# EAGLE schematic KMO_SRV_MV1 (EAGLE 9.1.3)

## Sheet 1 of 2
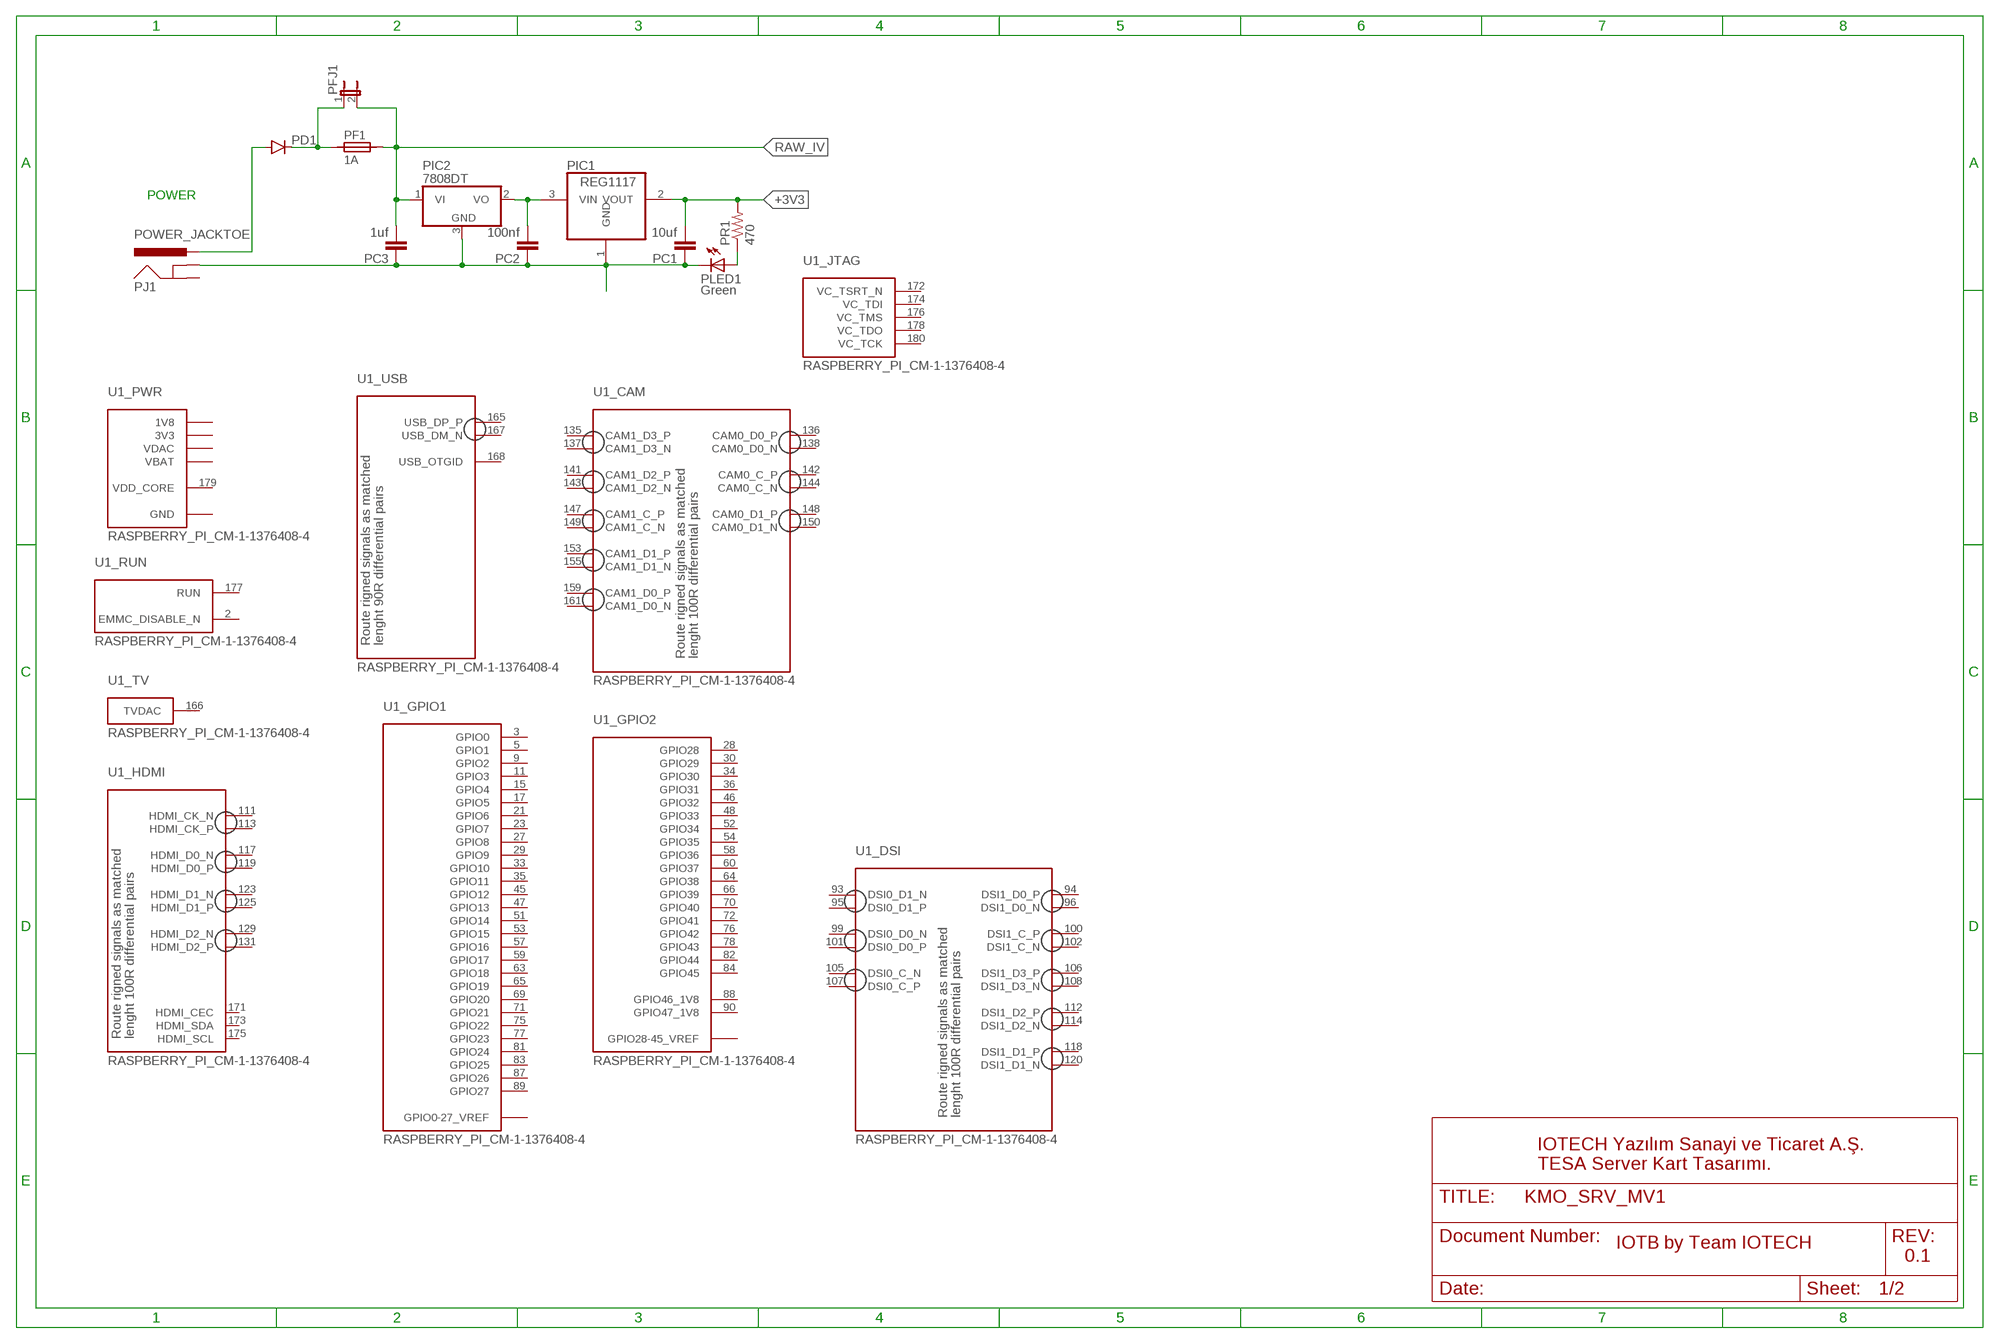
[diagram p0: schematic, sheet 1, part 1 of 2]
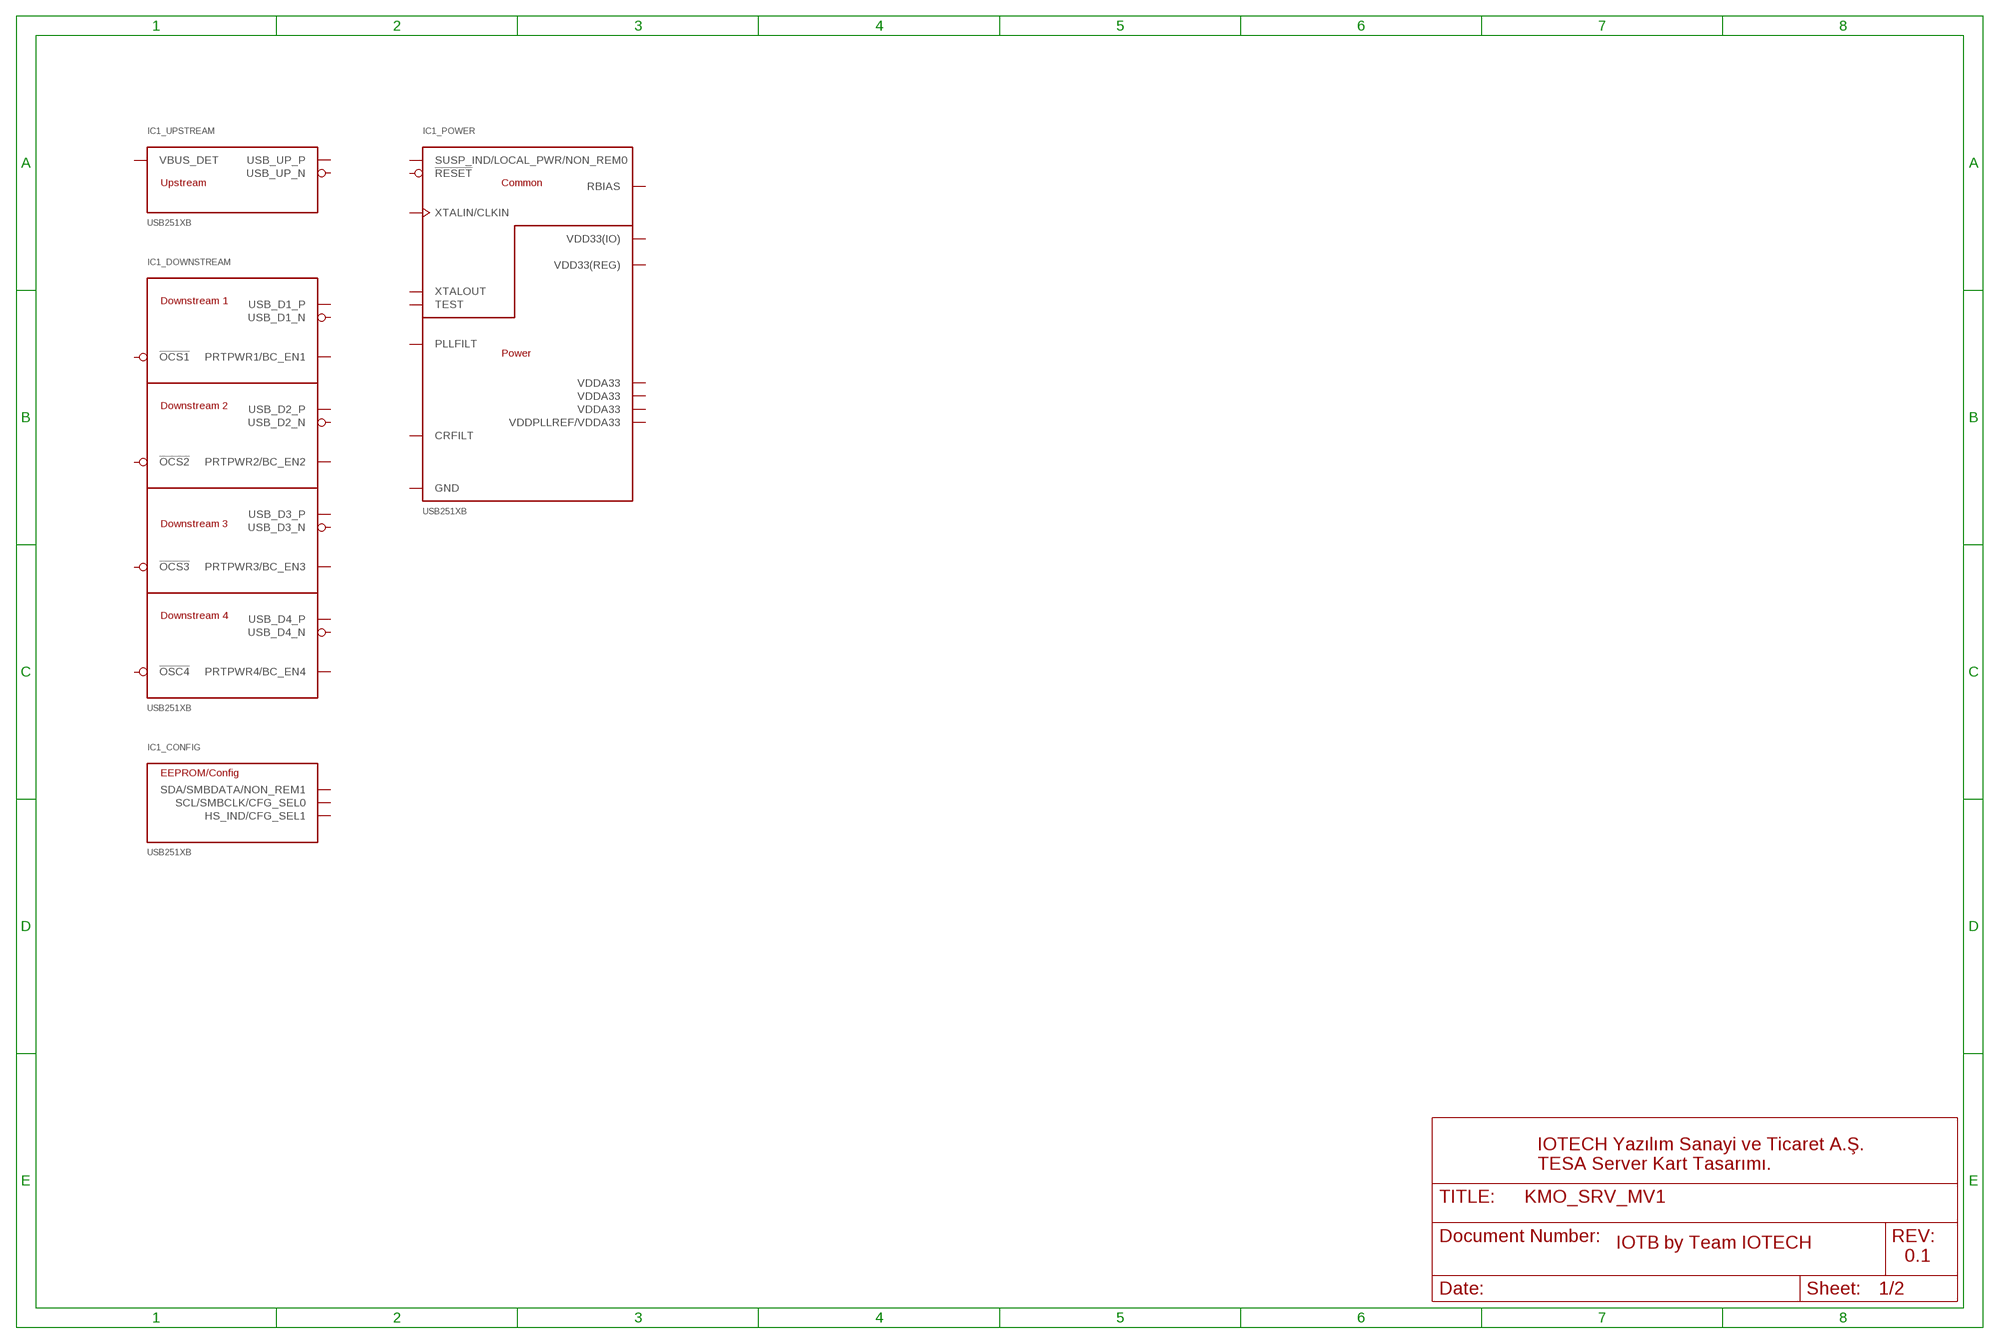
[diagram p1: schematic, sheet 1, part 2 of 2]

### Parts
IC1  USB251XB  [QFN36-CENTRE-MASK]
PC1  10uf  CAP0805  [0805]
PC2  100nf  CAP0805  [0805]
PC3  1uf  CAP0805  [0805]
PD1  DIODESMA  [SMA-DIODE]
PF1  1A  SIBA194600  [1820]
PFJ1  JP1E  [JP1]
PIC1  REG1117  [SOT223]
PIC2  7808DT  [TO252]
PJ1  POWER_JACKTOE  [POWER_JACK_SMD_OVERPASTE_TOE]
PLED1  Green  LEDCHIP-LED0805  [CHIP-LED0805]
PR1  470  RESISTOR0805-RES  [0805]
U1  RASPBERRY_PI_CM-1-1376408-4  [1-1376408-4]

### Nets
+3V3: PC1.2 PIC1.2(VOUT) PR1.2
N$2: PD1.C PF1.1 PFJ1.1
N$5: PC1.1 PC2.1 PC3.1 PIC1.1(GND) PIC2.3(GND) PJ1.GND(GNDBREAK) PLED1.C
N$7: PD1.A PJ1.VIN0(PWR)
N$11: PLED1.A PR1.1
N$12: PC2.2 PIC1.3(VIN) PIC2.2(VO)
RAW_IV [vcc]: PC3.2 PF1.2 PFJ1.2 PIC2.1(VI)
Unconnected: IC1.1(_DOWNSTREAM:USB_D1_N) IC1.2(_DOWNSTREAM:USB_D1_P) IC1.3(_DOWNSTREAM:USB_D2_N) IC1.4(_DOWNSTREAM:USB_D2_P) IC1.6(_DOWNSTREAM:USB_D3_N) IC1.7(_DOWNSTREAM:USB_D3_P) IC1.8(_DOWNSTREAM:USB_D4_N) IC1.9(_DOWNSTREAM:USB_D4_P) IC1.11(_POWER:TEST) IC1.12(_DOWNSTREAM:PRTPWR1/BC_EN1) IC1.13(_DOWNSTREAM:!OCS1) IC1.14(_POWER:CRFILT) IC1.16(_DOWNSTREAM:PRTPWR2/BC_EN2) IC1.17(_DOWNSTREAM:!OCS2) IC1.18(_DOWNSTREAM:PRTPWR3/BC_EN3) IC1.19(_DOWNSTREAM:!OCS3) IC1.20(_DOWNSTREAM:PRTPWR4/BC_EN4) IC1.21(_DOWNSTREAM:!OSC4) IC1.22(_CONFIG:SDA/SMBDATA/NON_REM1) IC1.24(_CONFIG:SCL/SMBCLK/CFG_SEL0) IC1.25(_CONFIG:HS_IND/CFG_SEL1) IC1.26(_POWER:!RESET) IC1.27(_UPSTREAM:VBUS_DET) IC1.28(_POWER:SUSP_IND/LOCAL_PWR/NON_REM0) IC1.30(_UPSTREAM:USB_UP_N) IC1.31(_UPSTREAM:USB_UP_P) IC1.32(_POWER:XTALOUT) IC1.33(_POWER:XTALIN/CLKIN) IC1.34(_POWER:PLLFILT) IC1.35(_POWER:RBIAS) PJ1.P$4(GND) U1.1(_PWR:GND) U1.2(_RUN:EMMC_DISABLE_N) U1.3(_GPIO1:GPIO0) U1.5(_GPIO1:GPIO1) U1.7(_PWR:GND) U1.9(_GPIO1:GPIO2) U1.11(_GPIO1:GPIO3) U1.13(_PWR:GND) U1.15(_GPIO1:GPIO4) U1.17(_GPIO1:GPIO5) U1.19(_PWR:GND) U1.21(_GPIO1:GPIO6) U1.23(_GPIO1:GPIO7) U1.25(_PWR:GND) U1.26(_PWR:GND) U1.27(_GPIO1:GPIO8) U1.28(_GPIO2:GPIO28) U1.29(_GPIO1:GPIO9) U1.30(_GPIO2:GPIO29) U1.31(_PWR:GND) U1.32(_PWR:GND) U1.33(_GPIO1:GPIO10) U1.34(_GPIO2:GPIO30) U1.35(_GPIO1:GPIO11) U1.36(_GPIO2:GPIO31) U1.37(_PWR:GND) U1.38(_PWR:GND) U1.39(_GPIO1:GPIO0-27_VREF) U1.40(_GPIO1:GPIO0-27_VREF) U1.41(_GPIO2:GPIO28-45_VREF) U1.42(_GPIO2:GPIO28-45_VREF) U1.43(_PWR:GND) U1.44(_PWR:GND) U1.45(_GPIO1:GPIO12) U1.46(_GPIO2:GPIO32) U1.47(_GPIO1:GPIO13) U1.48(_GPIO2:GPIO33) U1.49(_PWR:GND) U1.50(_PWR:GND) U1.51(_GPIO1:GPIO14) U1.52(_GPIO2:GPIO34) U1.53(_GPIO1:GPIO15) U1.54(_GPIO2:GPIO35) U1.55(_PWR:GND) U1.56(_PWR:GND) U1.57(_GPIO1:GPIO16) U1.58(_GPIO2:GPIO36) U1.59(_GPIO1:GPIO17) U1.60(_GPIO2:GPIO37) U1.61(_PWR:GND) U1.62(_PWR:GND) U1.63(_GPIO1:GPIO18) U1.64(_GPIO2:GPIO38) U1.65(_GPIO1:GPIO19) U1.66(_GPIO2:GPIO39) U1.67(_PWR:GND) U1.68(_PWR:GND) U1.69(_GPIO1:GPIO20) U1.70(_GPIO2:GPIO40) U1.71(_GPIO1:GPIO21) U1.72(_GPIO2:GPIO41) U1.73(_PWR:GND) U1.74(_PWR:GND) U1.75(_GPIO1:GPIO22) U1.76(_GPIO2:GPIO42) U1.77(_GPIO1:GPIO23) U1.78(_GPIO2:GPIO43) U1.79(_PWR:GND) U1.80(_PWR:GND) U1.81(_GPIO1:GPIO24) U1.82(_GPIO2:GPIO44) U1.83(_GPIO1:GPIO25) U1.84(_GPIO2:GPIO45) U1.85(_PWR:GND) U1.86(_PWR:GND) U1.87(_GPIO1:GPIO26) U1.88(_GPIO2:GPIO46_1V8) U1.89(_GPIO1:GPIO27) U1.90(_GPIO2:GPIO47_1V8) U1.91(_PWR:GND) U1.92(_PWR:GND) U1.93(_DSI:DSI0_D1_N) U1.94(_DSI:DSI1_D0_P) U1.95(_DSI:DSI0_D1_P) U1.96(_DSI:DSI1_D0_N) U1.97(_PWR:GND) U1.98(_PWR:GND) U1.99(_DSI:DSI0_D0_N) U1.100(_DSI:DSI1_C_P) U1.101(_DSI:DSI0_D0_P) U1.102(_DSI:DSI1_C_N) U1.103(_PWR:GND) U1.104(_PWR:GND) U1.105(_DSI:DSI0_C_N) U1.106(_DSI:DSI1_D3_P) U1.107(_DSI:DSI0_C_P) U1.108(_DSI:DSI1_D3_N) U1.109(_PWR:GND) U1.110(_PWR:GND) U1.111(_HDMI:HDMI_CK_N) U1.112(_DSI:DSI1_D2_P) U1.113(_HDMI:HDMI_CK_P) U1.114(_DSI:DSI1_D2_N) U1.115(_PWR:GND) U1.116(_PWR:GND) U1.117(_HDMI:HDMI_D0_N) U1.118(_DSI:DSI1_D1_P) U1.119(_HDMI:HDMI_D0_P) U1.120(_DSI:DSI1_D1_N) U1.121(_PWR:GND) U1.122(_PWR:GND) U1.123(_HDMI:HDMI_D1_N) U1.125(_HDMI:HDMI_D1_P) U1.127(_PWR:GND) U1.129(_HDMI:HDMI_D2_N) U1.131(_HDMI:HDMI_D2_P) U1.133(_PWR:GND) U1.134(_PWR:GND) U1.135(_CAM:CAM1_D3_P) U1.136(_CAM:CAM0_D0_P) U1.137(_CAM:CAM1_D3_N) U1.138(_CAM:CAM0_D0_N) U1.139(_PWR:GND) U1.140(_PWR:GND) U1.141(_CAM:CAM1_D2_P) U1.142(_CAM:CAM0_C_P) U1.143(_CAM:CAM1_D2_N) U1.144(_CAM:CAM0_C_N) U1.145(_PWR:GND) U1.146(_PWR:GND) U1.147(_CAM:CAM1_C_P) U1.148(_CAM:CAM0_D1_P) U1.149(_CAM:CAM1_C_N) U1.150(_CAM:CAM0_D1_N) U1.151(_PWR:GND) U1.152(_PWR:GND) U1.153(_CAM:CAM1_D1_P) U1.155(_CAM:CAM1_D1_N) U1.157(_PWR:GND) U1.159(_CAM:CAM1_D0_P) U1.161(_CAM:CAM1_D0_N) U1.163(_PWR:GND) U1.164(_PWR:GND) U1.165(_USB:USB_DP_P) U1.166(_TV:TVDAC) U1.167(_USB:USB_DM_N) U1.168(_USB:USB_OTGID) U1.169(_PWR:GND) U1.170(_PWR:GND) U1.171(_HDMI:HDMI_CEC) U1.172(_JTAG:VC_TSRT_N) U1.173(_HDMI:HDMI_SDA) U1.174(_JTAG:VC_TDI) U1.175(_HDMI:HDMI_SCL) U1.176(_JTAG:VC_TMS) U1.177(_RUN:RUN) U1.178(_JTAG:VC_TDO) U1.179(_PWR:VDD_CORE) U1.180(_JTAG:VC_TCK) U1.181(_PWR:GND) U1.182(_PWR:GND) U1.183(_PWR:1V8) U1.184(_PWR:1V8) U1.185(_PWR:1V8) U1.186(_PWR:1V8) U1.187(_PWR:GND) U1.188(_PWR:GND) U1.189(_PWR:VDAC) U1.190(_PWR:VDAC) U1.191(_PWR:3V3) U1.192(_PWR:3V3) U1.193(_PWR:3V3) U1.194(_PWR:3V3) U1.195(_PWR:GND) U1.196(_PWR:GND) U1.197(_PWR:VBAT) U1.198(_PWR:VBAT) U1.199(_PWR:VBAT) U1.200(_PWR:VBAT)

### Notes on the sheet
- POWER
- IOTECH Yazılım Sanayi ve Ticaret A.Ş.
  TESA Server Kart Tasarımı.
- IOTECH Yazılım Sanayi ve Ticaret A.Ş.
  TESA Server Kart Tasarımı.
- IOTB by Team IOTECH | IOTB by Team IOTECH
- 0.1 | 0.1

## Sheet 2 of 2
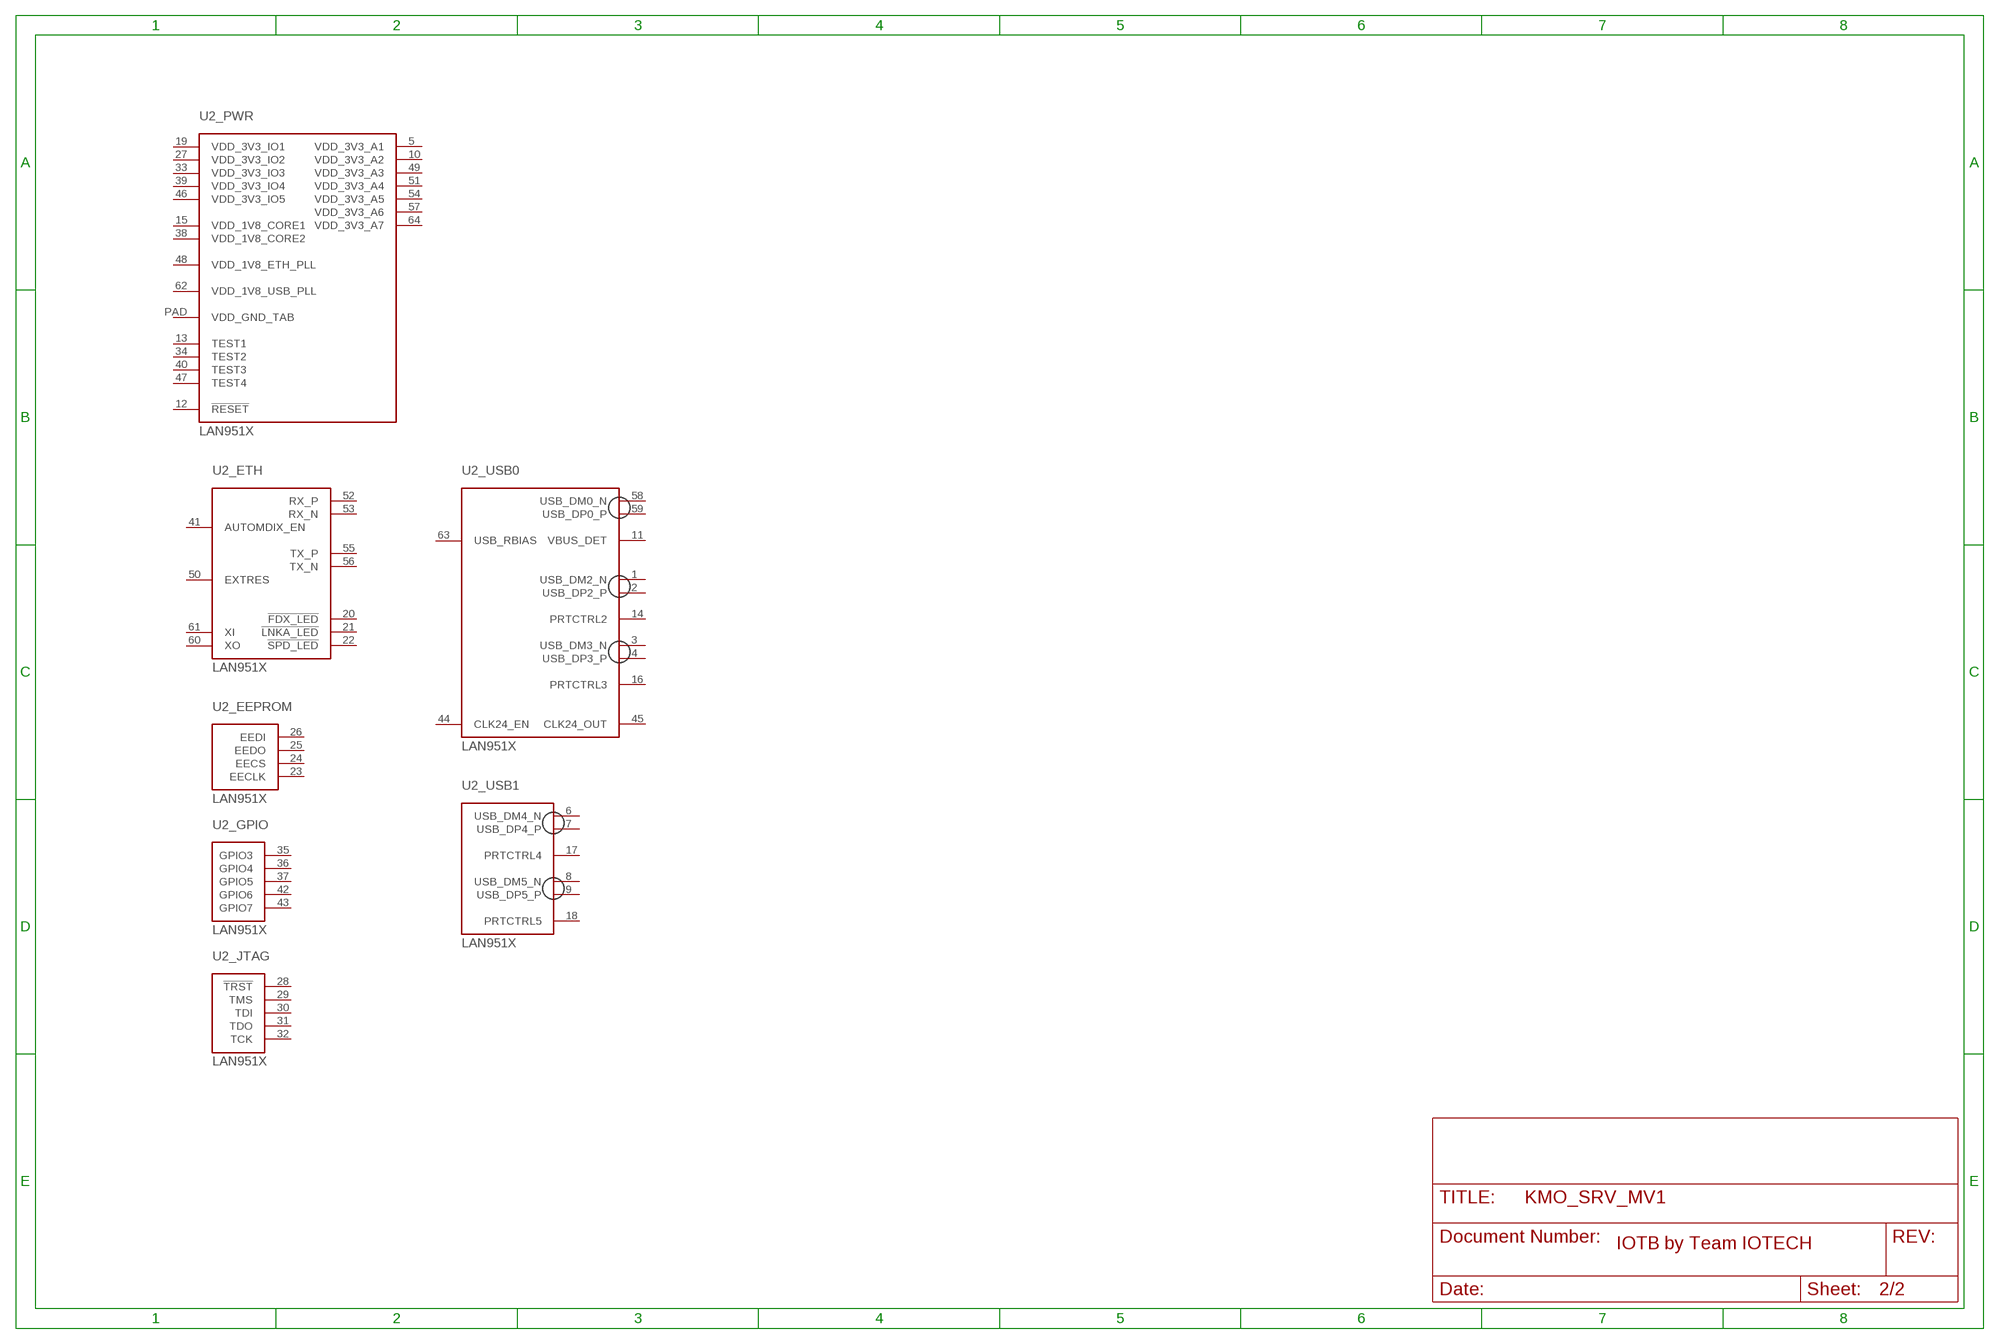
[diagram p2: schematic, sheet 2]

### Parts
U2  LAN951X  [QFN-64]
Unconnected: U2.1(_USB0:USB_DM2_N) U2.2(_USB0:USB_DP2_P) U2.3(_USB0:USB_DM3_N) U2.4(_USB0:USB_DP3_P) U2.5(_PWR:VDD_3V3_A1) U2.6(_USB1:USB_DM4_N) U2.7(_USB1:USB_DP4_P) U2.8(_USB1:USB_DM5_N) U2.9(_USB1:USB_DP5_P) U2.10(_PWR:VDD_3V3_A2) U2.11(_USB0:VBUS_DET) U2.12(_PWR:!RESET) U2.13(_PWR:TEST1) U2.14(_USB0:PRTCTRL2) U2.15(_PWR:VDD_1V8_CORE1) U2.16(_USB0:PRTCTRL3) U2.17(_USB1:PRTCTRL4) U2.18(_USB1:PRTCTRL5) U2.19(_PWR:VDD_3V3_IO1) U2.20(_ETH:!FDX_LED) U2.21(_ETH:!LNKA_LED) U2.22(_ETH:!SPD_LED) U2.23(_EEPROM:EECLK) U2.24(_EEPROM:EECS) U2.25(_EEPROM:EEDO) U2.26(_EEPROM:EEDI) U2.27(_PWR:VDD_3V3_IO2) U2.28(_JTAG:!TRST) U2.29(_JTAG:TMS) U2.30(_JTAG:TDI) U2.31(_JTAG:TDO) U2.32(_JTAG:TCK) U2.33(_PWR:VDD_3V3_IO3) U2.34(_PWR:TEST2) U2.35(_GPIO:GPIO3) U2.36(_GPIO:GPIO4) U2.37(_GPIO:GPIO5) U2.38(_PWR:VDD_1V8_CORE2) U2.39(_PWR:VDD_3V3_IO4) U2.40(_PWR:TEST3) U2.41(_ETH:AUTOMDIX_EN) U2.42(_GPIO:GPIO6) U2.43(_GPIO:GPIO7) U2.44(_USB0:CLK24_EN) U2.45(_USB0:CLK24_OUT) U2.46(_PWR:VDD_3V3_IO5) U2.47(_PWR:TEST4) U2.48(_PWR:VDD_1V8_ETH_PLL) U2.49(_PWR:VDD_3V3_A3) U2.50(_ETH:EXTRES) U2.51(_PWR:VDD_3V3_A4) U2.52(_ETH:RX_P) U2.53(_ETH:RX_N) U2.54(_PWR:VDD_3V3_A5) U2.55(_ETH:TX_P) U2.56(_ETH:TX_N) U2.57(_PWR:VDD_3V3_A6) U2.58(_USB0:USB_DM0_N) U2.59(_USB0:USB_DP0_P) U2.60(_ETH:XO) U2.61(_ETH:XI) U2.62(_PWR:VDD_1V8_USB_PLL) U2.63(_USB0:USB_RBIAS) U2.64(_PWR:VDD_3V3_A7) U2.PAD(_PWR:VDD_GND_TAB)

### Notes on the sheet
- IOTB by Team IOTECH

## Power pins joined to a net without a drawn wire
GND: IC1.PAD(_POWER:GND)
VDD33(IO): IC1.23(_POWER:VDD33(IO))
VDD33(REG): IC1.15(_POWER:VDD33(REG))
VDDA33: IC1.5(_POWER:VDDA33) IC1.10(_POWER:VDDA33) IC1.29(_POWER:VDDA33)
VDDPLLREF/VDDA33: IC1.36(_POWER:VDDPLLREF/VDDA33)

## Library data of the parts
IC1 = Ciseco Pi Compute Module:USB251XB
PC1-PC3 = SparkFun-Capacitors:CAP: Capacitor Standard 0603 ceramic capacitor, and 0.1" leaded capacitor.
PD1 = SparkFun-DiscreteSemi:DIODE: Diode These are standard reverse protection diodes and small signal diodes. SMA package can handle up to about 1A. SOD-323 can handle about 200mA. What the SOD-323 package when ordering, there are some mfgs out there that are 5-pin packages.
PF1 = _hhn_PtcFuses_Siba_r500_Ozan:SIBA194600*: SIBA PTC-Fuses, Series 194600, 1812 (4.5 3.2)mm Source: www.siba.de/ Package: SMD 1812 (4.5 x 3.2)mm Technologies: SIBA194600Axxx xxx: Trip-Current * 10 mA Author: Dipl.-Ing. FH Rainer Bayer
PFJ1 = jumper:JP1E: JUMPER
PIC1 = burr-brown:REG1117: 800mA and 1A Low Dropout (LDO) Positive Regulator 1.8V, 2.5V, 2.85V, 3.3V, 5V, and Adj; MPN: REG1117; OC_FARNELL: 1097566; OC_NEWARK: 14P6981
PIC2 = linear:78*: Positive VOLTAGE REGULATOR Source: http://cache.national.com/ds/LM/LM78L05.pdf http://www.fairchildsemi.com/ds/LM/LM7805.pdf
PJ1 = SparkFun-Connectors:POWER_JACK: Power Jack Connector This is the standard 5.5mm barrel jack for power. The PTH is the most common, proven, reliable, footprint. The Slot footprint only works if the mill layer is transmitted to the PCB fab house so be warned. Here are the connectors we sell at SparkFun: DC Barrel Power Jack/Connector <https://www.sparkfun.com/products/119> (PRT-00119) DC Barrel Power Jack/Connector (SMD) <https://www.sparkfun.com/products/12748> (PRT-12748) DC Barrel Jack Adapter - Breadboard Compatible <https://www.sparkfun.com/products/10811> (PRT-10811) It is used on this SparkFun product (and many, many others): SparkFun RedBoard - Programmed with Arduino <https://www.sparkfun.com/products/12757> (DEV-12757) Also, if you need a mating power supply or connector, please check these out: Wall Adapter Power Supply - 9VDC 650mA <https://www.sparkfun.com/products/298> (TOL-00298) DC Barrel Jack Adapter - Male <https://www.sparkfun.com/products/10287> (PRT-10287); PROD_ID: CONN-08106; SF_ID: PRT-12748
PLED1 = led:LED: LED OSRAM: - CHIPLED LG R971, LG N971, LY N971, LG Q971, LY Q971, LO R971, LY R971 LH N974, LH R974 LS Q976, LO Q976, LY Q976 LO Q996 - Hyper CHIPLED LW Q18S LB Q993, LB Q99A, LB R99A - SideLED LS A670, LO A670, LY A670, LG A670, LP A670 LB A673, LV A673, LT A673, LW A673 LH A674 LY A675 LS A676, LA A676, LO A676, LY A676, LW A676 LS A679, LY A679, LG A679 - Hyper Micro SIDELED® LS Y876, LA Y876, LO Y876, LY Y876 LT Y87S - SmartLED LW L88C, LW L88S LB L89C, LB L89S, LG L890 LS L89K, LO L89K, LY L89K LS L896, LA L896, LO L896, LY L896 - TOPLED LS T670, LO T670, LY T670, LG T670, LP T670 LSG T670, LSP T670, LSY T670, LOP T670, LYG T670 LG T671, LOG T671, LSG T671 LB T673, LV T673, LT T673, LW T673 LH T674 LS T676, LA T676, LO T676, LY T676, LB T676, LH T676, LSB T676, LW T676 LB T67C, LV T67C, LT T67C, LS T67K, LO T67K, LY T67K, LW E67C LS E67B, LA E67B, LO E67B, LY E67B, LB E67C, LV E67C, LT E67C LW T67C LS T679, LY T679, LG T679 LS T770, LO T770, LY T770, LG T770, LP T770 LB T773, LV T773, LT T773, LW T773 LH T774 LS E675, LA E675, LY E675, LS T675 LS T776, LA T776, LO T776, LY T776, LB T776 LHGB T686 LT T68C, LB T68C - Hyper Mini TOPLED® LB M676 - Mini TOPLED Santana® LG M470 LS M47K, LO M47K, LY M47K Source: http://www.osram.convergy.de LUXEON: - LUMILED® LXK2-PW12-R00, LXK2-PW12-S00, LXK2-PW14-U00, LXK2-PW14-V00 LXK2-PM12-R00, LXK2-PM12-S00, LXK2-PM14-U00 LXK2-PE12-Q00, LXK2-PE12-R00, LXK2-PE12-S00, LXK2-PE14-T00, LXK2-PE14-U00 LXK2-PB12-K00, LXK2-PB12-L00, LXK2-PB12-M00, LXK2-PB14-N00, LXK2-PB14-P00, LXK2-PB14-Q00 LXK2-PR12-L00, LXK2-PR12-M00, LXK2-PR14-Q00, LXK2-PR14-R00 LXK2-PD12-Q00, LXK2-PD12-R00, LXK2-PD12-S00 LXK2-PH12-R00, LXK2-PH12-S00 LXK2-PL12-P00, LXK2-PL12-Q00, LXK2-PL12-R00 Source: www.luxeon.com KINGBRIGHT: KA-3528ASYC Source: www.kingbright.com
PR1 = SparkFun-Passives:RESISTOR: Resistor Basic schematic elements and footprints for 0603, 1206, and PTH resistors.
U1 = Ciseco Pi Compute Module:RASPBERRY_PI_CM: Raspberry Pi Compute Module As anounced in this blog post http://www.raspberrypi.org/raspberry-pi-compute-module-new-product/ Based on infomation from this schematic http://www.raspberrypi.org/wp-content/uploads/2014/04/RPI-CM-V1_1-SCHEMATIC.pdf Footprint is unproven and no matching part confimed as of yet
U2 = Ciseco Pi Compute Module:LAN951X: LAN951X LAN9512 has two downstream USB ports LAN9514 has four downstream USB ports The same footprint is use for both but for LAN9512 (2 port) accpications the _USB1 block signals should be NC

## Net classes
0 default: width 0.203 mm, drill 0.3 mm, clearance 0.16 mm
1 vcc: width 0.254 mm, drill 0.3 mm, clearance 0.16 mm